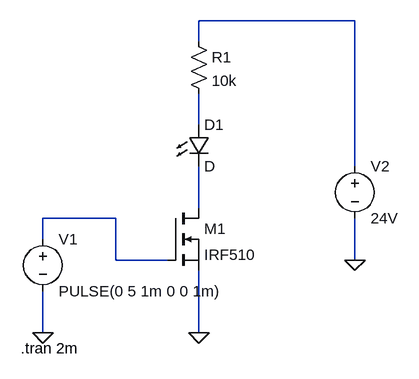
[diagram p0: schematic Draft12.asc]
Draft12.asc, the LTspice schematic file:
Version 4
SHEET 1 880 680
WIRE 400 -208 160 -208
WIRE 160 -176 160 -208
WIRE 160 -48 160 -96
WIRE 400 16 400 -208
WIRE 160 80 160 16
WIRE 32 96 -80 96
WIRE -80 128 -80 96
WIRE 32 160 32 96
WIRE 112 160 32 160
WIRE 400 160 400 96
WIRE -80 272 -80 208
WIRE 160 272 160 176
FLAG -80 272 0
FLAG 160 272 0
FLAG 400 160 0
SYMBOL nmos 112 80 R0
SYMATTR InstName M1
SYMATTR Value IRF510
SYMBOL voltage -80 112 R0
WINDOW 123 0 0 Left 0
WINDOW 39 0 0 Left 0
SYMATTR InstName V1
SYMATTR Value PULSE(0 5 1m 0 0 1m)
SYMBOL voltage 400 0 R0
WINDOW 123 0 0 Left 0
WINDOW 39 0 0 Left 0
SYMATTR InstName V2
SYMATTR Value 24V
SYMBOL res 144 -192 R0
SYMATTR InstName R1
SYMATTR Value 10k
SYMBOL LED 144 -48 R0
SYMATTR InstName D1
TEXT -114 296 Left 2 !.tran 2m

The netlist it stands for:
* Draft12.asc
M1 N003 N004 0 0 IRF510
V1 N004 0 PULSE(0 5 1m 0 0 1m)
V2 N001 0 24V
R1 N001 N002 10k
D1 N002 N003 D
.model D D
.lib standard.dio
.model NMOS NMOS
.model PMOS PMOS
.lib standard.mos
.tran 2m
.backanno
.end